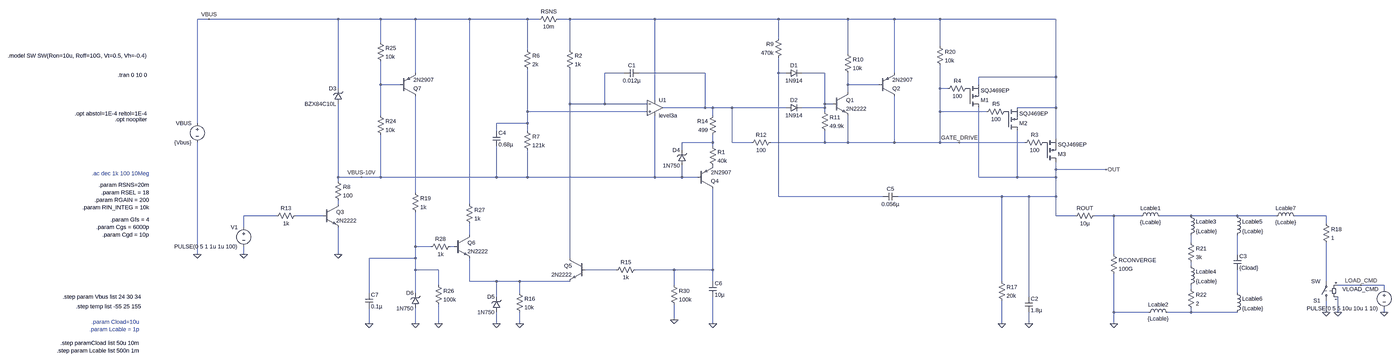
[diagram p0: schematic Hybrid_RPC.asc, whole sheet]
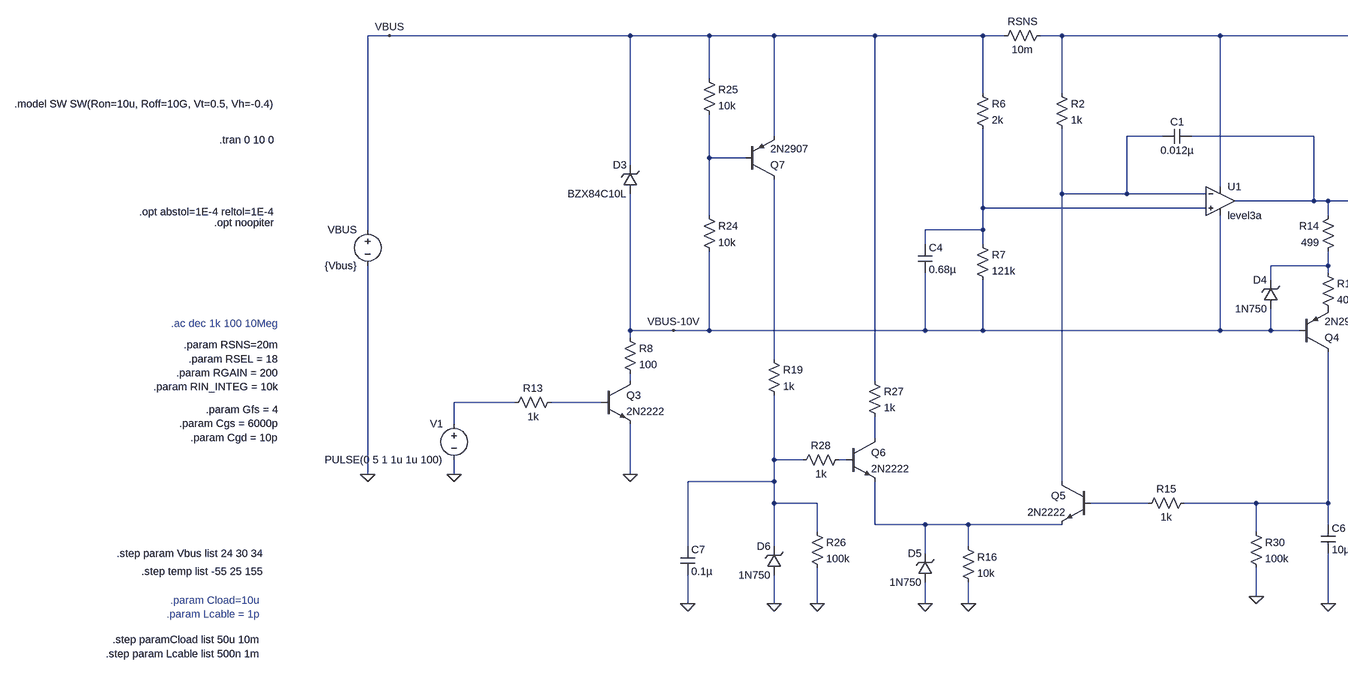
[diagram p1: schematic Hybrid_RPC.asc, part, row 1 of 1, column 1 of 2]
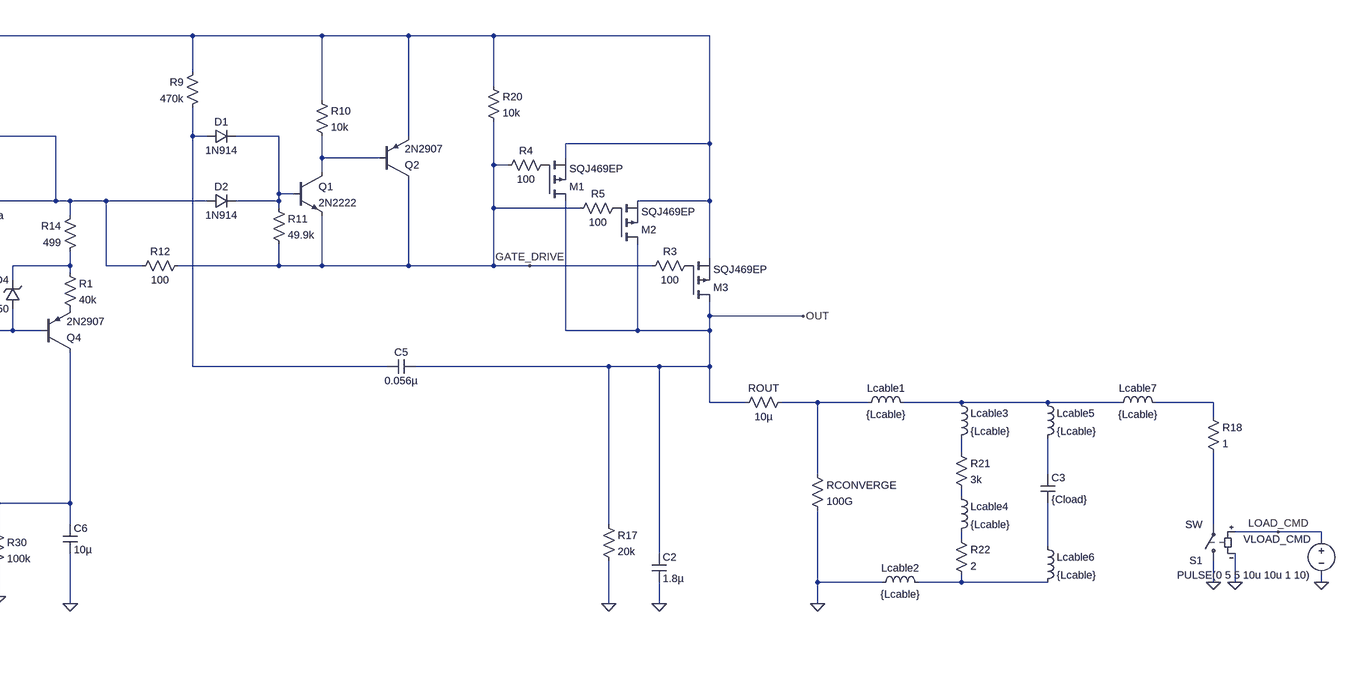
[diagram p2: schematic Hybrid_RPC.asc, part, row 1 of 1, column 2 of 2]
Hybrid_RPC.asc, the LTspice schematic file:
Version 4.1
SHEET 1 2692 1988
WIRE -2288 -208 -2336 -208
WIRE -1744 -208 -2288 -208
WIRE -1568 -208 -1744 -208
WIRE -1424 -208 -1568 -208
WIRE -1200 -208 -1424 -208
WIRE -960 -208 -1200 -208
WIRE -912 -208 -960 -208
WIRE -784 -208 -832 -208
WIRE -432 -208 -784 -208
WIRE 80 -208 -432 -208
WIRE 368 -208 80 -208
WIRE 560 -208 368 -208
WIRE 816 -208 560 -208
WIRE 1296 -208 816 -208
WIRE 80 -128 80 -208
WIRE -1568 -112 -1568 -208
WIRE 816 -96 816 -208
WIRE -960 -80 -960 -208
WIRE -784 -80 -784 -208
WIRE 368 -64 368 -208
WIRE -1424 16 -1424 -208
WIRE -560 16 -640 16
WIRE -224 16 -496 16
WIRE 80 16 80 -48
WIRE 112 16 80 16
WIRE 272 16 176 16
WIRE 560 16 560 -208
WIRE 1296 32 1296 -208
WIRE 1296 32 976 32
WIRE -1568 64 -1568 -32
WIRE -1488 64 -1568 64
WIRE 368 64 368 16
WIRE 496 64 368 64
WIRE 976 64 976 32
WIRE -1744 80 -1744 -208
WIRE 816 80 816 -16
WIRE 848 80 816 80
WIRE 368 96 368 64
WIRE -432 128 -432 -208
WIRE -784 144 -784 0
WIRE -640 144 -640 16
WIRE -640 144 -784 144
WIRE -464 144 -640 144
WIRE 272 144 272 16
WIRE 304 144 272 144
WIRE -224 160 -224 16
WIRE -224 160 -400 160
WIRE -192 160 -224 160
WIRE -112 160 -192 160
WIRE 112 160 -112 160
WIRE 272 160 272 144
WIRE 272 160 176 160
WIRE 1296 160 1296 32
WIRE 1296 160 1136 160
WIRE -960 176 -960 0
WIRE -464 176 -960 176
WIRE 272 176 272 160
WIRE 816 176 816 80
WIRE 1008 176 816 176
WIRE -1568 192 -1568 64
WIRE -192 192 -192 160
WIRE -2336 224 -2336 -208
WIRE -960 224 -960 176
WIRE -960 224 -1088 224
WIRE -1088 256 -1088 224
WIRE -960 256 -960 224
WIRE 1296 288 1296 160
WIRE -192 304 -192 272
WIRE -192 304 -320 304
WIRE -112 304 -112 160
WIRE -32 304 -112 304
WIRE 272 304 272 256
WIRE 272 304 48 304
WIRE 368 304 368 192
WIRE 368 304 272 304
WIRE 560 304 560 112
WIRE 560 304 368 304
WIRE 816 304 816 176
WIRE 816 304 560 304
WIRE 896 304 816 304
WIRE 1168 304 896 304
WIRE -192 320 -192 304
WIRE -320 336 -320 304
WIRE 1296 416 1296 384
WIRE 1504 416 1296 416
WIRE -1744 448 -1744 144
WIRE -1648 448 -1744 448
WIRE -1568 448 -1568 272
WIRE -1568 448 -1648 448
WIRE -1088 448 -1088 320
WIRE -1088 448 -1568 448
WIRE -960 448 -960 336
WIRE -960 448 -1088 448
WIRE -432 448 -432 192
WIRE -432 448 -960 448
WIRE -320 448 -320 400
WIRE -320 448 -432 448
WIRE -256 448 -320 448
WIRE 976 448 976 160
WIRE 1136 448 1136 256
WIRE 1136 448 976 448
WIRE 1296 448 1296 416
WIRE 1296 448 1136 448
WIRE -1744 464 -1744 448
WIRE -1424 512 -1424 112
WIRE 80 528 80 16
WIRE 512 528 80 528
WIRE 1072 528 576 528
WIRE 1184 528 1072 528
WIRE 1296 528 1296 448
WIRE 1296 528 1184 528
WIRE -1744 560 -1744 544
WIRE -1200 560 -1200 -208
WIRE -2000 608 -2144 608
WIRE -1808 608 -1920 608
WIRE 1296 608 1296 528
WIRE 1376 608 1296 608
WIRE 1536 608 1456 608
WIRE 1648 608 1536 608
WIRE 1856 608 1728 608
WIRE 2048 608 1856 608
WIRE 2208 608 2048 608
WIRE 2416 608 2288 608
WIRE 2416 640 2416 608
WIRE -2144 656 -2144 608
WIRE -1200 688 -1200 640
WIRE 1856 720 1856 688
WIRE -1424 736 -1424 592
WIRE -1360 736 -1424 736
WIRE -1264 736 -1280 736
WIRE -2336 768 -2336 304
WIRE -2144 768 -2144 736
WIRE -1744 768 -1744 656
WIRE 1536 768 1536 608
WIRE 2048 768 2048 688
WIRE -1424 784 -1424 736
WIRE -1424 784 -1616 784
WIRE -784 784 -784 144
WIRE 1856 816 1856 800
WIRE -1424 832 -1424 784
WIRE -1328 832 -1424 832
WIRE -592 832 -720 832
WIRE -352 832 -512 832
WIRE -192 832 -192 496
WIRE -192 832 -352 832
WIRE -1200 880 -1200 784
WIRE -1088 880 -1200 880
WIRE -992 880 -1088 880
WIRE -784 880 -992 880
WIRE -192 880 -192 832
WIRE 1072 880 1072 528
WIRE 2416 880 2416 720
WIRE -1328 896 -1328 832
WIRE -352 896 -352 832
WIRE 2560 896 2464 896
WIRE 2656 896 2560 896
WIRE 1856 912 1856 896
WIRE 2656 912 2656 896
WIRE -1616 928 -1616 784
WIRE -1424 928 -1424 832
WIRE -992 928 -992 880
WIRE 2048 928 2048 832
WIRE -1088 944 -1088 880
WIRE 1184 944 1184 528
WIRE 1536 1008 1536 848
WIRE 1680 1008 1536 1008
WIRE 1856 1008 1856 992
WIRE 1856 1008 1760 1008
WIRE 2048 1008 1856 1008
WIRE 2416 1008 2416 960
WIRE 2464 1008 2464 944
WIRE 2656 1008 2656 992
WIRE -352 1040 -352 976
WIRE -1616 1056 -1616 992
WIRE -1424 1056 -1424 992
WIRE -1328 1056 -1328 976
WIRE -1088 1056 -1088 1008
WIRE -992 1056 -992 1008
WIRE -192 1056 -192 944
WIRE 1072 1056 1072 960
WIRE 1184 1056 1184 1008
WIRE 1536 1056 1536 1008
FLAG 896 304 GATE_DRIVE
FLAG -2336 768 0
FLAG -2288 -208 VBUS
FLAG 1072 1056 0
FLAG 1184 1056 0
FLAG 2416 1008 0
FLAG 2656 1008 0
FLAG 2464 1008 0
FLAG 2560 896 LOAD_CMD
FLAG 1536 1056 0
FLAG 1504 416 OUT
FLAG -1648 448 VBUS-10V
FLAG -1744 768 0
FLAG -2144 768 0
FLAG -192 1056 0
FLAG -352 1040 0
FLAG -1424 1056 0
FLAG -992 1056 0
FLAG -1088 1056 0
FLAG -1616 1056 0
FLAG -1328 1056 0
DATAFLAG 1376 416 ""
DATAFLAG 208 -208 ""
DATAFLAG 208 -208 ""
DATAFLAG 800 144 ""
DATAFLAG -1712 -208 ""
DATAFLAG -1712 -208 ""
DATAFLAG 1568 608 ""
DATAFLAG 1568 608 ""
SYMBOL res 1264 288 R90
WINDOW 0 0 56 VBottom 2
WINDOW 3 32 56 VTop 2
SYMATTR InstName R3
SYMATTR Value 100
SYMBOL res -928 -192 R270
WINDOW 0 32 56 VTop 2
WINDOW 3 0 56 VBottom 2
SYMATTR InstName RSNS
SYMATTR Value 10m
SYMBOL voltage -2336 208 M0
SYMATTR InstName VBUS
SYMATTR Value {Vbus}
SYMBOL res 1056 864 R0
SYMATTR InstName R17
SYMATTR Value 20k
SYMBOL cap 1168 944 R0
SYMATTR InstName C2
SYMATTR Value 1.8µ
SYMBOL sw 2416 976 R180
SYMATTR InstName S1
SYMBOL voltage 2656 896 M0
WINDOW 123 0 0 Left 0
WINDOW 39 0 0 Left 0
SYMATTR InstName VLOAD_CMD
SYMATTR Value PULSE(0 5 5 10u 10u 1 10)
SYMBOL res 1360 624 R270
WINDOW 0 32 56 VTop 2
WINDOW 3 0 56 VBottom 2
SYMATTR InstName ROUT
SYMATTR Value 10µ
SYMBOL res 800 -112 R0
SYMATTR InstName R20
SYMATTR Value 10k
SYMBOL pmos 1248 384 M180
SYMATTR InstName M3
SYMATTR Value SQJ469EP
SYMBOL res 1520 752 R0
SYMATTR InstName RCONVERGE
SYMATTR Value 100G
SYMBOL ind 1632 624 R270
WINDOW 0 32 56 VTop 2
WINDOW 3 5 56 VBottom 2
SYMATTR InstName Lcable1
SYMATTR Value {Lcable}
SYMBOL ind 1664 1024 R270
WINDOW 0 32 56 VTop 2
WINDOW 3 5 56 VBottom 2
SYMATTR InstName Lcable2
SYMATTR Value {Lcable}
SYMBOL ind 1840 592 R0
SYMATTR InstName Lcable3
SYMATTR Value {Lcable}
SYMBOL res 1840 704 R0
SYMATTR InstName R21
SYMATTR Value 3k
SYMBOL ind 1840 800 R0
SYMATTR InstName Lcable4
SYMATTR Value {Lcable}
SYMBOL res 1840 896 R0
SYMATTR InstName R22
SYMATTR Value 2
SYMBOL ind 2032 592 R0
SYMATTR InstName Lcable5
SYMATTR Value {Lcable}
SYMBOL ind 2032 912 R0
SYMATTR InstName Lcable6
SYMATTR Value {Lcable}
SYMBOL cap 2032 768 R0
SYMATTR InstName C3
SYMATTR Value {Cload}
SYMBOL ind 2192 624 R270
WINDOW 0 32 56 VTop 2
WINDOW 3 5 56 VBottom 2
SYMATTR InstName Lcable7
SYMATTR Value {Lcable}
SYMBOL res 2400 624 R0
SYMATTR InstName R18
SYMATTR Value 1
SYMBOL res 944 64 R90
WINDOW 0 0 56 VBottom 2
WINDOW 3 32 56 VTop 2
SYMATTR InstName R4
SYMATTR Value 100
SYMBOL pmos 928 160 M180
SYMATTR InstName M1
SYMATTR Value SQJ469EP
SYMBOL res 1104 160 R90
WINDOW 0 0 56 VBottom 2
WINDOW 3 32 56 VTop 2
SYMATTR InstName R5
SYMATTR Value 100
SYMBOL pmos 1088 256 M180
SYMATTR InstName M2
SYMATTR Value SQJ469EP
SYMBOL res -800 -96 R0
SYMATTR InstName R2
SYMATTR Value 1k
SYMBOL res -976 -96 R0
SYMATTR InstName R6
SYMATTR Value 2k
SYMBOL cap -496 0 R90
WINDOW 0 0 32 VBottom 2
WINDOW 3 32 32 VTop 2
SYMATTR InstName C1
SYMATTR Value 0.012µ
SYMBOL res -976 240 R0
SYMATTR InstName R7
SYMATTR Value 121k
SYMBOL cap -1104 256 R0
SYMATTR InstName C4
SYMATTR Value 0.68µ
SYMBOL cap 576 512 R90
WINDOW 0 0 32 VBottom 2
WINDOW 3 32 32 VTop 2
SYMATTR InstName C5
SYMATTR Value 0.056µ
SYMBOL OpAmps\\UniversalOpAmp3 -432 160 R0
SYMATTR InstName U1
SYMATTR Value2 Avol=1Meg GBW=10G Slew=10Meg
SYMATTR SpiceLine Ilimit=50m Rail=0 Vos=0 Phimargin=60
SYMBOL res 96 -144 M0
SYMATTR InstName R9
SYMATTR Value 470k
SYMBOL diode 112 32 R270
WINDOW 0 32 32 VTop 2
WINDOW 3 0 32 VBottom 2
SYMATTR InstName D1
SYMATTR Value 1N914
SYMBOL diode 112 176 R270
WINDOW 0 32 32 VTop 2
WINDOW 3 0 32 VBottom 2
SYMATTR InstName D2
SYMATTR Value 1N914
SYMBOL npn 304 96 R0
SYMATTR InstName Q1
SYMATTR Value 2N2222
SYMBOL res 352 -80 R0
SYMATTR InstName R10
SYMATTR Value 10k
SYMBOL pnp 496 112 M180
SYMATTR InstName Q2
SYMATTR Value 2N2907
SYMBOL res 256 160 R0
SYMATTR InstName R11
SYMATTR Value 49.9k
SYMBOL res 64 288 R90
WINDOW 0 0 56 VBottom 2
WINDOW 3 32 56 VTop 2
SYMATTR InstName R12
SYMATTR Value 100
SYMBOL zener -1728 144 R180
WINDOW 0 24 64 Left 2
WINDOW 3 24 0 Left 2
SYMATTR InstName D3
SYMATTR Value BZX84C10L
SYMBOL res -1760 448 R0
SYMATTR InstName R8
SYMATTR Value 100
SYMBOL npn -1808 560 R0
SYMATTR InstName Q3
SYMATTR Value 2N2222
SYMBOL voltage -2144 640 M0
WINDOW 123 0 0 Left 0
WINDOW 39 0 0 Left 0
SYMATTR InstName V1
SYMATTR Value PULSE(0 5 1 1u 1u 100)
SYMBOL res -1904 592 R90
WINDOW 0 0 56 VBottom 2
WINDOW 3 32 56 VTop 2
SYMATTR InstName R13
SYMATTR Value 1k
SYMBOL pnp -256 496 M180
SYMATTR InstName Q4
SYMATTR Value 2N2907
SYMBOL zener -304 400 R180
WINDOW 0 24 64 Left 2
WINDOW 3 24 0 Left 2
SYMATTR InstName D4
SYMATTR Value 1N750
SYMBOL cap -208 880 R0
SYMATTR InstName C6
SYMATTR Value 10µ
SYMBOL npn -720 784 M0
SYMATTR InstName Q5
SYMATTR Value 2N2222
SYMBOL npn -1264 688 R0
SYMATTR InstName Q6
SYMATTR Value 2N2222
SYMBOL res -1008 912 R0
SYMATTR InstName R16
SYMATTR Value 10k
SYMBOL zener -1072 1008 R180
WINDOW 0 24 64 Left 2
WINDOW 3 24 0 Left 2
SYMATTR InstName D5
SYMATTR Value 1N750
SYMBOL zener -1408 992 R180
WINDOW 0 24 64 Left 2
WINDOW 3 24 0 Left 2
SYMATTR InstName D6
SYMATTR Value 1N750
SYMBOL res -1216 544 R0
SYMATTR InstName R27
SYMATTR Value 1k
SYMBOL res -1264 720 R90
WINDOW 0 0 56 VBottom 2
WINDOW 3 32 56 VTop 2
SYMATTR InstName R28
SYMATTR Value 1k
SYMBOL res -368 880 R0
SYMATTR InstName R30
SYMATTR Value 100k
SYMBOL cap -1632 928 R0
SYMATTR InstName C7
SYMATTR Value 0.1µ
SYMBOL res -1344 880 R0
SYMATTR InstName R26
SYMATTR Value 100k
SYMBOL res -1584 176 R0
SYMATTR InstName R24
SYMATTR Value 10k
SYMBOL res -1584 -128 R0
SYMATTR InstName R25
SYMATTR Value 10k
SYMBOL pnp -1488 112 M180
SYMATTR InstName Q7
SYMATTR Value 2N2907
SYMBOL res -496 816 R90
WINDOW 0 0 56 VBottom 2
WINDOW 3 32 56 VTop 2
SYMATTR InstName R15
SYMATTR Value 1k
SYMBOL res -176 176 M0
SYMATTR InstName R14
SYMATTR Value 499
SYMBOL res -208 304 R0
SYMATTR InstName R1
SYMATTR Value 40k
SYMBOL res -1440 496 R0
SYMATTR InstName R19
SYMATTR Value 1k
TEXT -2568 480 Right 2 !.param RSNS=20m\n.param RSEL = 18\n.param RGAIN = 200\n.param RIN_INTEG = 10k
TEXT -2576 -56 Right 2 !.model SW SW(Ron=10u, Roff=10G, Vt=0.5, Vh=-0.4)
TEXT -2576 24 Right 2 !.tran 0 10 0
TEXT -2568 432 Right 2 ;.ac dec 1k 100 10Meg
TEXT -2568 624 Right 2 !.param Gfs = 4\n.param Cgs = 6000p\n.param Cgd = 10p
TEXT -2576 208 Right 2 !.opt noopiter
TEXT -2576 184 Right 2 !.opt abstol=1E-4 reltol=1E-4
TEXT -2608 1136 Right 2 !.step paramCload list 50u 10m\n.step param Lcable list 500n 1m
TEXT -2600 984 Right 2 !.step temp list -55 25 155
TEXT -2608 1048 Right 2 ;.param Cload=10u\n.param Lcable = 1p
TEXT -2600 944 Right 2 !.step param Vbus list 24 30 34

The netlist it stands for:
* Hybrid_RPC.asc
R3 P001 GATE_DRIVE 100
RSNS VBUS N001 10m
VBUS VBUS 0 {Vbus}
R17 OUT 0 20k
C2 OUT 0 1.8µ
S1 0 N026 LOAD_CMD 0 SW
VLOAD_CMD LOAD_CMD 0 PULSE(0 5 5 10u 10u 1 10)
ROUT OUT N014 10µ
R20 N001 GATE_DRIVE 10k
M3 OUT P001 N001 N001 SQJ469EP
RCONVERGE N014 0 100G
Lcable1 N014 N015 {Lcable}
Lcable2 0 N029 {Lcable}
Lcable3 N015 N018 {Lcable}
R21 N018 N022 3k
Lcable4 N022 N027 {Lcable}
R22 N027 N029 2
Lcable5 N015 N021 {Lcable}
Lcable6 N028 N029 {Lcable}
C3 N021 N028 {Cload}
Lcable7 N015 N016 {Lcable}
R18 N016 N026 1
R4 P002 GATE_DRIVE 100
M1 OUT P002 N001 N001 SQJ469EP
R5 P003 GATE_DRIVE 100
M2 OUT P003 N001 N001 SQJ469EP
R2 N001 N002 1k
R6 VBUS N008 2k
C1 N003 N002 0.012µ
R7 N008 VBUS-10V 121k
C4 N008 VBUS-10V 0.68µ
C5 OUT N004 0.056µ
X§U1 N008 N002 N001 VBUS-10V N003 level3a Avol=1Meg GBW=10G Slew=10Meg Ilimit=50m Rail=0 Vos=0 Phimargin=60  ; pins In+ In- V+ V- OUT
R9 N001 N004 470k
D1 N004 N005 1N914
D2 N003 N005 1N914
Q1 N007 N005 GATE_DRIVE 0 2N2222
R10 N001 N007 10k
Q2 GATE_DRIVE N007 N001 0 2N2907
R11 N005 GATE_DRIVE 49.9k
R12 GATE_DRIVE N003 100
D3 VBUS-10V VBUS BZX84C10L
R8 VBUS-10V N011 100
Q3 N011 N013 0 0 2N2222
V1 N012 0 PULSE(0 5 1 1u 1u 100)
R13 N013 N012 1k
Q4 N024 VBUS-10V P004 0 2N2907
D4 VBUS-10V N009 1N750
C6 N024 0 10µ
Q5 N002 N023 N025 0 2N2222
Q6 N017 N020 N025 0 2N2222
R16 N025 0 10k
D5 0 N025 1N750
D6 0 N019 1N750
R27 VBUS N017 1k
R28 N020 N019 1k
R30 N024 0 100k
C7 N019 0 0.1µ
R26 N019 0 100k
R24 N006 VBUS-10V 10k
R25 VBUS N006 10k
Q7 N010 N006 VBUS 0 2N2907
R15 N024 N023 1k
R14 N003 N009 499
R1 N009 P004 40k
R19 N010 N019 1k
.model D D
.lib standard.dio
.model NPN NPN
.model PNP PNP
.lib standard.bjt
.model NMOS NMOS
.model PMOS PMOS
.lib standard.mos
.param RSNS=20m
.param RSEL = 18
.param RGAIN = 200
.param RIN_INTEG = 10k
.model SW SW(Ron=10u, Roff=10G, Vt=0.5, Vh=-0.4)
.tran 0 10 0
* .ac dec 1k 100 10Meg
.param Gfs = 4
.param Cgs = 6000p
.param Cgd = 10p
.opt noopiter
.opt abstol=1E-4 reltol=1E-4
.step paramCload list 50u 10m
.step param Lcable list 500n 1m
.step temp list -55 25 155
* .param Cload=10u
* .param Lcable = 1p
.step param Vbus list 24 30 34
.backanno
.end